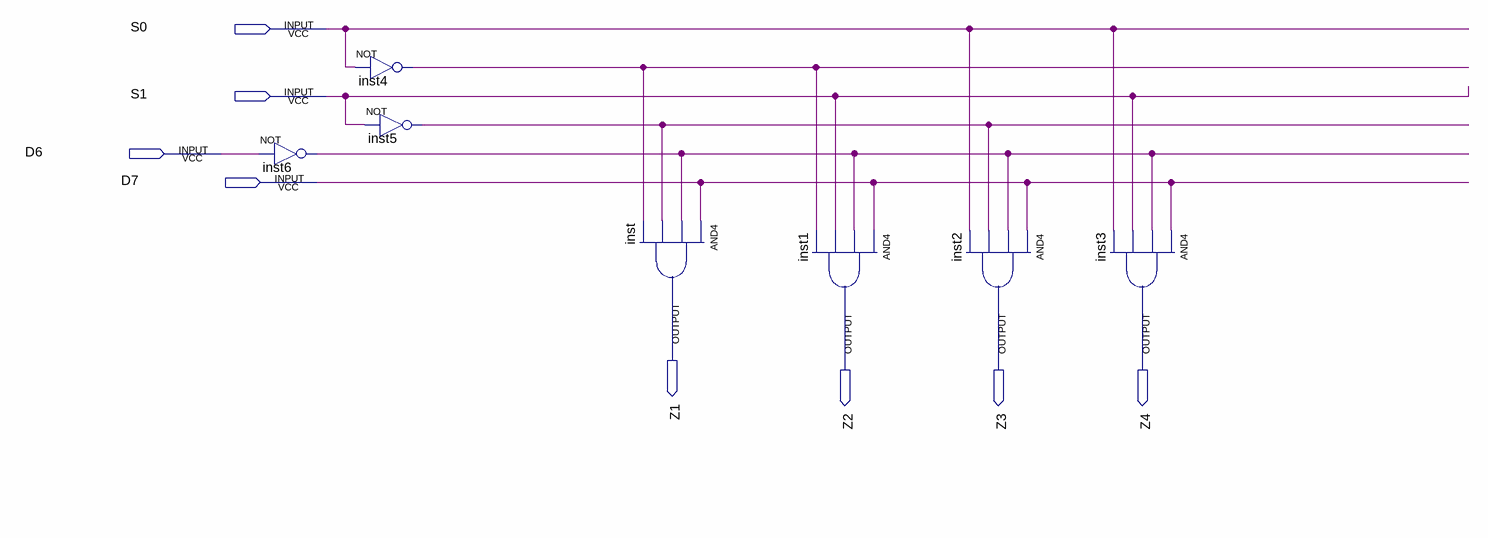
[diagram p0: schematic sheet]
// Quartus schematic Demux2x4.bdf as structural Verilog: 7 symbols, 8 pins
module Demux2x4 (
  input  S0,
  input  S1,
  input  D6,
  input  D7,
  output Z1,
  output Z2,
  output Z3,
  output Z4
);

  wire inst4_out, inst5_out, inst6_out;

  not inst6 (inst6_out, D6);
  not inst4 (inst4_out, S0);
  not inst5 (inst5_out, S1);
  and inst (Z1, D7, inst6_out, inst5_out, inst4_out);
  and inst1 (Z2, D7, inst6_out, S1, inst4_out);
  and inst2 (Z3, D7, inst6_out, inst5_out, S0);
  and inst3 (Z4, D7, inst6_out, S1, S0);
endmodule
